# EasyEDA Pro project ProDoc_PCB7_2024-06-06.epro, board PCB7
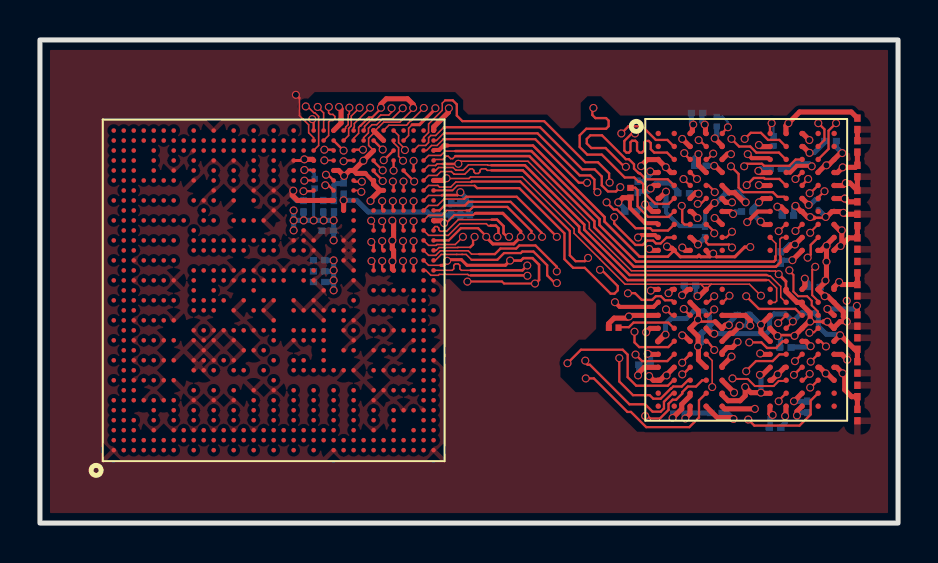
[diagram p0: board, top side]
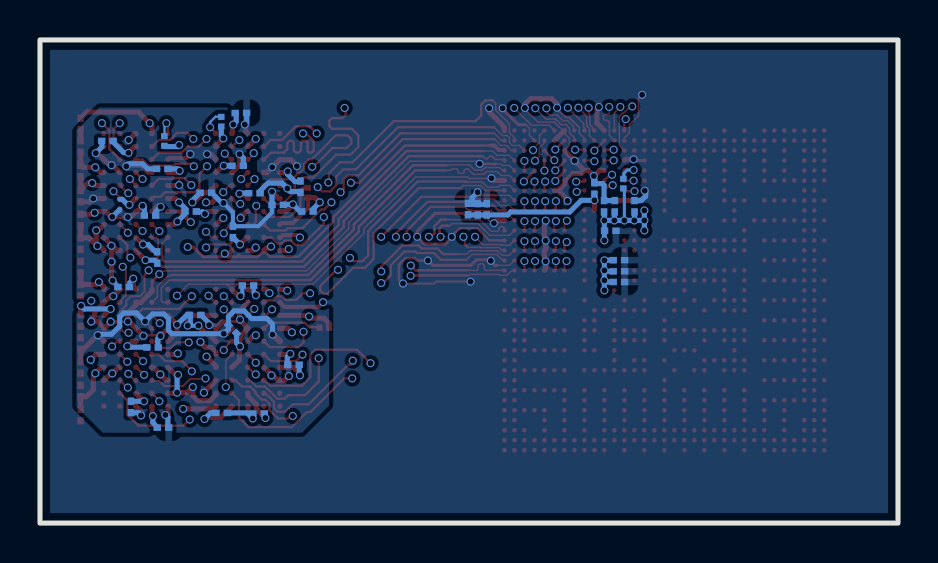
[diagram p1: board, bottom side, seen from below]

Outline 42.93 x 24.18 mm; copper layers: Top Layer, Inner1, Inner2, Inner3, Inner4, Inner5, Inner6, Bottom Layer. Coordinates in mm from the lower left corner of the outline.
Outline path: rectangle 0,24.18 42.93,0
Stack: Top Layer 0.035mm 外层铜厚1oz / Dielectric1 0.1164mm 2116 RC54% 4.9mil / Inner1 0.0152mm 内层铜厚 / Dielectric2 0.3mm 0.3mm H/HOZ 不含铜 / Inner2 0.0152mm 内层铜厚 / Dielectric3 0.0764mm 1080 RC67% 3.3mil / Inner3 0.0152mm 内层铜厚 / Dielectric4 0.0764mm 1080 RC67% 3.3mil / Inner4 0.0152mm 内层铜厚 / Dielectric5 0.3mm 0.3mm H/HOZ 不含铜 / Inner5 0.0152mm 内层铜厚 / Dielectric6 0.0764mm 1080 RC67% 3.3mil / Inner6 0.0152mm 内层铜厚 / Dielectric7 0.0764mm 1080 RC67% 3.3mil / Bottom Layer 0.035mm 外层铜厚1oz

## Design rules (mm)
net SDQM2: SDQ2
net SDQ22: SDQ2
net SDQ24: SDQ3
net SDQ21: SDQ2
net SDQ20: SDQ2
net SDQ31: SDQ3
net SDQ23: SDQ2
net SDQ19: SDQ2
net SDQ30: SDQ3
net SDQS2P: SDQ2
net SDQS2N: SDQ2
net SDQ26: SDQ3
net SDQ27: SDQ3
net SDQS3P: SDQ3
net SDQS3N: SDQ3
net SDQ17: SDQ2
net SDQM3: SDQ3
net SDQ18: SDQ2
net SDQ16: SDQ2
net SDQ28: SDQ3
net SDQ25: SDQ3
net SDQ29: SDQ3
net SAB2: SAA
net SAB3: SAA
net SAA5: SAA
net SAB0: SAA
net SCS0-B: SCK
net SCS1-B: SCK
net SCKE1-B: SCK
net SCKP-B: SCK
net SCKE0-B: SCK
net SAB1: SAA
net SAB5: SAA
net SCKN-B: SCK
net SAB4: SAA
net SCKE0-A: SCK
net SCS0-A: SCK
net SCKN-A: SCK
net SDQ14: SDQ1
net SAA4: SAA
net SDQ13: SDQ1
net SDQ12: SDQ1
net SDQ15: SDQ1
net SAA3: SAA
net SDQM1: SDQ1
net SDQS1P: SDQ1
net SDQS1N: SDQ1
net SDQ9: SDQ1
net SAA2: SAA
net SDQ10: SDQ1
net SDQ11: SDQ1
net SDQ8: SDQ1
net SCKP-A: SCK
net SCKE1-A: SCK
net SDQ1: SDQ0
net SDQ5: SDQ0
net SDQ7: SDQ0
net SDQ0: SDQ0
net SCS1-A: SCK
net SDQM0: SDQ0
net SDQS0P: SDQ0
net SDQS0N: SDQ0
net SDQ3: SDQ0
net SAA0: SAA
net SDQ4: SDQ0
net SDQ6: SDQ0
net SAA1: SAA
net SDQ2: SDQ0
template: 8L BGA
spacing safeClearance (default): track to track 0.076, other pairs 0.076 to 0.3
track width trackWidth (default): min 0.076, default 0.102, max 2.54
differential pair differentialPair (default): width min 0.102, default 0.254, max 2.54; gap min 0.102, default 0.102
via viaSize (default): diameter min 0.4, default 0.45, max 10; hole min 0.201, default 0.201, max 5.999
pour e746 uses DRAMCopper
pour e789 uses DRAMCopper
pour e875 uses DRAMCopper
pour e939 uses DRAMCopper
pour e1925 uses DRAMCopper

## Placement (name value [footprint] x y rotation side)
C1  2.2uF  [c0201 nsk]  33.83 5.51 180 bottom
C2  2.2uF  [c0201 nsk]  35.15 10.41 180 bottom
C3  100nF  [c0201 nsk]  36.78 4.78 0 bottom
C4  100nF  [c0201 nsk]  37.3 8.79 0 bottom
C5  100nF  [c0201 nsk]  39.55 19.13 180 bottom
C6  100nF  [c0201 nsk]  13.97 12.07 0 bottom
C7  100nF  [c0201 nsk]  13.97 12.6 0 bottom
C8  100nF  [c0201 nsk]  13.97 13.16 0 bottom
C9  100nF  [c0201 nsk]  14.71 15.85 270 bottom
C10  100nF  [c0201 nsk]  13.18 15.85 270 bottom
C11  100nF  [c0201 nsk]  14.17 15.85 270 bottom
C12  100nF  [c0201 nsk]  37.06 13.28 270 bottom
C13  100nF  [c0201 nsk]  36.8 17.73 180 bottom
C14  100nF  [c0201 nsk]  31.98 5.48 180 bottom
C15  100nF  [c0201 nsk]  32.51 11.89 180 bottom
C16  100nF  [c0201 nsk]  38.73 11.81 180 bottom
C17  2.2uF  [c0201 nsk]  15.19 16.75 90 bottom
C18  100nF  [c0201 nsk]  20.57 15.7 270 bottom
C19  2.2uF  [c0201 nsk]  40.89 8.99 90 top
C20  100nF  [c0201 nsk]  40.89 7.8 90 top
C21  100nF  [c0201 nsk]  37.41 15.39 180 bottom
C22  100nF  [c0201 nsk]  33.3 9.7 45 bottom
C23  100nF  [c0201 nsk]  31.04 15.93 0 bottom
C24  100nF  [c0201 nsk]  40.89 16.36 270 top
C25  100nF  [c0201 nsk]  33.27 14.58 90 bottom
C26  100nF  [c0201 nsk]  34.62 16.54 180 bottom
C27  2.2uF  [c0201 nsk]  30.25 7.92 0 bottom
C28  2.2uF  [c0201 nsk]  40.89 10.13 270 top
C29  100nF  [c0201 nsk]  35.39 15.6 0 bottom
C30  100nF  [c0201 nsk]  40.89 19.99 90 top
C31  100nF  [c0201 nsk]  40.89 18.85 270 top
C32  2.2uF  [c0201 nsk]  32.87 20.52 180 bottom
C33  100nF  [c0201 nsk]  40.89 17.63 90 top
C34  100nF  [c0201 nsk]  40.89 14 90 top
C35  100nF  [c0201 nsk]  40.89 11.66 90 top
C36  100nF  [c0201 nsk]  40.89 15.16 270 top
C37  100nF  [c0201 nsk]  40.89 12.8 270 top
C38  100nF  [c0201 nsk]  40.89 5.41 90 top
C39  100nF  [c0201 nsk]  40.89 6.6 270 top
C40  100nF  [c0201 nsk]  14.4 14.63 0 bottom
C41  100nF  [c0201 nsk]  33.05 17.88 0 bottom
C42  100nF  [c0201 nsk]  38.38 5.82 90 bottom
C43  100nF  [c0201 nsk]  32.21 16.51 0 bottom
C44  100nF  [c0201 nsk]  29.9 16.84 90 bottom
C45  100nF  [c0201 nsk]  29.54 15.6 180 bottom
C46  2.2uF  [c0201 nsk]  21.51 15.72 90 bottom
C47  100nF  [c0201 nsk]  21.03 15.7 270 bottom
R1  0  [r0201 nsk]  29.54 16.54 270 top
R2  0  [r0201 nsk]  28.7 9.78 180 top
R3  120  [r0201 nsk]  13.74 16.99 270 bottom
R4  240  [r0201 nsk]  33.86 20.09 270 bottom
R5  240  [r0201 nsk]  36.7 19.13 270 bottom
U1  T527  [T527-BGA664]  11.69 11.65 90 top
UD1  LPDDR4_FBGA200  [BGA200P65_80B1000_1500H90]  35.33 12.67 0 top

## Footprints (pads in the part's own frame, mm; a bottom-side part is the same pattern mirrored in y, then rotated)
BGA200P65_80B1000_1500H90
  round 0.27 smd: A1(-4.4,6.825) A2(-3.6,6.825) A3(-2.8,6.825) A4(-2,6.825) A5(-1.2,6.825) A8(1.2,6.825) A9(2,6.825) A10(2.8,6.825) A11(3.6,6.825) A12(4.4,6.825) AA1(-4.4,-6.175) AA2(-3.6,-6.175) AA3(-2.8,-6.175) AA4(-2,-6.175) AA5(-1.2,-6.175) AA8(1.2,-6.175) AA9(2,-6.175) AA10(2.8,-6.175) AA11(3.6,-6.175) AA12(4.4,-6.175) AB1(-4.4,-6.825) AB2(-3.6,-6.825) AB3(-2.8,-6.825) AB4(-2,-6.825) AB5(-1.2,-6.825) AB8(1.2,-6.825) AB9(2,-6.825) AB10(2.8,-6.825) AB11(3.6,-6.825) AB12(4.4,-6.825) B1(-4.4,6.175) B2(-3.6,6.175) B3(-2.8,6.175) B4(-2,6.175) B5(-1.2,6.175) B8(1.2,6.175) B9(2,6.175) B10(2.8,6.175) B11(3.6,6.175) B12(4.4,6.175) C1(-4.4,5.525) C2(-3.6,5.525) C3(-2.8,5.525) C4(-2,5.525) C5(-1.2,5.525) C8(1.2,5.525) C9(2,5.525) C10(2.8,5.525) C11(3.6,5.525) C12(4.4,5.525) D1(-4.4,4.875) D2(-3.6,4.875) D3(-2.8,4.875) D4(-2,4.875) D5(-1.2,4.875) D8(1.2,4.875) D9(2,4.875) D10(2.8,4.875) D11(3.6,4.875) D12(4.4,4.875) E1(-4.4,4.225) E2(-3.6,4.225) E3(-2.8,4.225) E4(-2,4.225) E5(-1.2,4.225) E8(1.2,4.225) E9(2,4.225) E10(2.8,4.225) E11(3.6,4.225) E12(4.4,4.225) F1(-4.4,3.575) F2(-3.6,3.575) F3(-2.8,3.575) F4(-2,3.575) F5(-1.2,3.575) F8(1.2,3.575) F9(2,3.575) F10(2.8,3.575) F11(3.6,3.575) F12(4.4,3.575) G1(-4.4,2.925) G2(-3.6,2.925) G3(-2.8,2.925) G4(-2,2.925) G5(-1.2,2.925) G8(1.2,2.925) G9(2,2.925) G10(2.8,2.925) G11(3.6,2.925) G12(4.4,2.925) H1(-4.4,2.275) H2(-3.6,2.275) H3(-2.8,2.275) H4(-2,2.275) H5(-1.2,2.275) H8(1.2,2.275) H9(2,2.275) H10(2.8,2.275) H11(3.6,2.275) H12(4.4,2.275) J1(-4.4,1.625) J2(-3.6,1.625) J3(-2.8,1.625) J4(-2,1.625) J5(-1.2,1.625) J8(1.2,1.625) J9(2,1.625) J10(2.8,1.625) J11(3.6,1.625) J12(4.4,1.625) K1(-4.4,0.975) K2(-3.6,0.975) K3(-2.8,0.975) K4(-2,0.975) K5(-1.2,0.975) K8(1.2,0.975) K9(2,0.975) K10(2.8,0.975) K11(3.6,0.975) K12(4.4,0.975) N1(-4.4,-0.975) N2(-3.6,-0.975) N3(-2.8,-0.975) N4(-2,-0.975) N5(-1.2,-0.975) N8(1.2,-0.975) N9(2,-0.975) N10(2.8,-0.975) N11(3.6,-0.975) N12(4.4,-0.975) P1(-4.4,-1.625) P2(-3.6,-1.625) P3(-2.8,-1.625) P4(-2,-1.625) P5(-1.2,-1.625) P8(1.2,-1.625) P9(2,-1.625) P10(2.8,-1.625) P11(3.6,-1.625) P12(4.4,-1.625) R1(-4.4,-2.275) R2(-3.6,-2.275) R3(-2.8,-2.275) R4(-2,-2.275) R5(-1.2,-2.275) R8(1.2,-2.275) R9(2,-2.275) R10(2.8,-2.275) R11(3.6,-2.275) R12(4.4,-2.275) T1(-4.4,-2.925) T2(-3.6,-2.925) T3(-2.8,-2.925) T4(-2,-2.925) T5(-1.2,-2.925) T8(1.2,-2.925) T9(2,-2.925) T10(2.8,-2.925) T11(3.6,-2.925) T12(4.4,-2.925) U1(-4.4,-3.575) U2(-3.6,-3.575) U3(-2.8,-3.575) U4(-2,-3.575) U5(-1.2,-3.575) U8(1.2,-3.575) U9(2,-3.575) U10(2.8,-3.575) U11(3.6,-3.575) U12(4.4,-3.575) V1(-4.4,-4.225) V2(-3.6,-4.225) V3(-2.8,-4.225) V4(-2,-4.225) V5(-1.2,-4.225) V8(1.2,-4.225) V9(2,-4.225) V10(2.8,-4.225) V11(3.6,-4.225) V12(4.4,-4.225) W1(-4.4,-4.875) W2(-3.6,-4.875) W3(-2.8,-4.875) W4(-2,-4.875) W5(-1.2,-4.875) W8(1.2,-4.875) W9(2,-4.875) W10(2.8,-4.875) W11(3.6,-4.875) W12(4.4,-4.875) Y1(-4.4,-5.525) Y2(-3.6,-5.525) Y3(-2.8,-5.525) Y4(-2,-5.525) Y5(-1.2,-5.525) Y8(1.2,-5.525) Y9(2,-5.525) Y10(2.8,-5.525) Y11(3.6,-5.525) Y12(4.4,-5.525)
c0201 nsk
  rect 0.368x0.324 smd: 1(-0.292,0) 2(0.28,0)
r0201 nsk
  rect 0.303x0.324 smd: 1(-0.241,0) 2(0.241,0)
T527-BGA664
  round 0.229 smd: A1(-8,8) A2(-7.5,8) A3(-7,8) A4(-6.5,8) A5(-6,8) A6(-5.5,8) A8(-4.5,8) A10(-3.5,8) A12(-2.5,8) A14(-1.5,8) A16(-0.5,8) A18(0.5,8) A20(1.5,8) A22(2.5,8) A24(3.5,8) A26(4.5,8) A28(5.5,8) A29(6,8) A30(6.5,8) A31(7,8) A32(7.5,8) A33(8,8) AA1(-8,-2) AA2(-7.5,-2) AA3(-7,-2) AA4(-6.5,-2) AA5(-6,-2) AA6(-5.5,-2) AA7(-5,-2) AA9(-4,-2) AA12(-2.5,-2) AA13(-2,-2) AA15(-1,-2) AA16(-0.5,-2) AA18(0.5,-2) AA19(1,-2) AA21(2,-2) AA22(2.5,-2) AA24(3.5,-2) AA26(4.5,-2) AA27(5,-2) AA28(5.5,-2) AA29(6,-2) AA30(6.5,-2) AA31(7,-2) AA32(7.5,-2) AA33(8,-2) AB2(-7.5,-2.501) AB3(-7,-2.5) AB9(-4,-2.501) AB10(-3.5,-2.5) AB11(-3,-2.5) AB12(-2.5,-2.5) AB13(-2,-2.5) AB14(-1.5,-2.5) AB15(-1,-2.5) AB17(0,-2.5) AB24(3.5,-2.5) AB32(7.5,-2.501) AB33(8,-2.5) AC1(-8,-3) AC2(-7.5,-3) AC3(-7,-3) AC4(-6.5,-3) AC5(-6,-3) AC6(-5.5,-3) AC7(-5,-3) AC9(-4,-3) AC15(-1,-3) AC17(0,-3) AC18(0.5,-3) AC19(1,-3) AC20(1.5,-3) AC22(2.5,-3) AC24(3.5,-3) AC26(4.5,-3) AC27(5,-3) AC28(5.5,-3) AC29(6,-3) AC30(6.5,-3) AC31(7,-3) AC32(7.5,-3) AC33(8,-3) AD1(-8,-3.5) AD2(-7.5,-3.5) AD9(-4,-3.5) AD11(-3,-3.5) AD13(-2,-3.5) AD14(-1.5,-3.5) AD15(-1,-3.5) AD20(1.5,-3.5) AD21(2,-3.5) AD22(2.5,-3.5) AD25(4,-3.5) AD32(7.5,-3.5) AD33(8,-3.5) AE1(-8,-4) AE2(-7.5,-4) AE3(-7,-4) AE4(-6.5,-4) AE5(-6,-4) AE6(-5.5,-4) AE7(-5,-4) AE9(-4,-4) AE11(-3,-4) AE12(-2.501,-4) AE13(-2,-4) AE14(-1.5,-4) AE16(-0.5,-4) AE18(0.5,-4) AE19(1,-4) AE20(1.5,-4) AE21(2,-4) AE22(2.501,-4) AE23(3,-4) AE24(3.5,-4) AE25(4,-4) AE26(4.5,-4) AE27(5,-4) AE28(5.5,-4) AE29(6,-4) AE30(6.5,-4) AE31(7,-4) AE32(7.5,-4) AE33(8,-4) AF1(-8,-4.5) AF2(-7.5,-4.5) AF32(7.5,-4.5) AF33(8,-4.5) AG1(-8,-5) AG2(-7.5,-5) AG3(-7,-5) AG4(-6.5,-5) AG5(-6,-5) AG6(-5.5,-5) AG7(-5,-5) AG9(-4,-5) AG11(-3,-5) AG13(-2,-5) AG15(-1,-5) AG17(0,-5) AG19(1,-5) AG21(2,-5) AG23(3,-5) AG25(4,-5) AG28(5.5,-5) AG29(6,-5) AG30(6.5,-5) AG31(7,-5) AG32(7.5,-5) AG33(8,-5) AH1(-8,-5.5) AH2(-7.5,-5.5) AH7(-5,-5.5) AH9(-4,-5.5) AH11(-3,-5.5) AH13(-2,-5.5) AH15(-1,-5.5) AH17(0,-5.5) AH19(1,-5.5) AH21(2,-5.5) AH23(3,-5.5) AH25(4,-5.5) AH27(5,-5.5) AH32(7.5,-5.5) AH33(8,-5.5) AJ1(-8,-6) AJ2(-7.5,-6) AJ3(-7,-6) AJ4(-6.5,-6) AJ5(-6,-6) AJ7(-5,-6) AJ9(-4,-6) AJ11(-3,-6) AJ13(-2,-6) AJ15(-1,-6) AJ17(0,-6) AJ19(1,-6) AJ21(2,-6) AJ23(3,-6) AJ25(4,-6) AJ27(5,-6) AJ30(6.5,-6) AJ31(7,-6) AJ32(7.5,-6) AJ33(8,-6) AK1(-8,-6.5) AK2(-7.5,-6.5) AK5(-6,-6.5) AK7(-5,-6.5) AK9(-4,-6.5) AK11(-3,-6.5) AK13(-2,-6.5) AK15(-1,-6.5) AK17(0,-6.5) AK19(1,-6.5) AK21(2,-6.5) AK23(3,-6.5) AK25(4,-6.5) AK27(5,-6.5) AK29(6,-6.5) AK32(7.5,-6.5) AK33(8,-6.5) AL1(-8,-7) AL2(-7.5,-7) AL3(-7,-7) AL5(-6,-7) AL7(-5,-7) AL9(-4,-7) AL11(-3,-7) AL12(-2.5,-7) AL13(-2,-7) AL14(-1.5,-7) AL15(-1,-7) AL16(-0.5,-7) AL17(0,-7) AL19(1,-7) AL21(2,-7) AL23(3,-7) AL25(4,-7) AL27(5,-7) AL29(6,-7) AL31(7,-7) AL32(7.5,-7) AL33(8,-7) AM1(-8,-7.5) AM2(-7.5,-7.5) AM3(-7,-7.5) AM4(-6.5,-7.5) AM5(-6,-7.5) AM6(-5.5,-7.5) AM7(-5,-7.5) AM8(-4.5,-7.5) AM9(-4,-7.5) AM10(-3.5,-7.5) AM11(-3,-7.5) AM12(-2.501,-7.5) AM13(-2,-7.5) AM14(-1.5,-7.5) AM15(-1,-7.5) AM16(-0.5,-7.5) AM17(0,-7.5) AM18(0.5,-7.5) AM19(1,-7.5) AM20(1.5,-7.5) AM21(2,-7.5) AM22(2.501,-7.5) AM23(3,-7.5) AM24(3.5,-7.5) AM25(4,-7.5) AM26(4.5,-7.5) AM27(5,-7.5) AM28(5.5,-7.5) AM29(6,-7.5) AM30(6.5,-7.5) AM31(7,-7.5) AM32(7.5,-7.5) AM33(8,-7.5) AN1(-8,-8) AN2(-7.5,-8) AN3(-7,-8) AN4(-6.5,-8) AN5(-6,-8) AN6(-5.5,-8) AN7(-5,-8) AN8(-4.5,-8) AN9(-4,-8) AN10(-3.5,-8) AN11(-3,-8) AN13(-2,-8) AN15(-1,-8) AN17(0,-8) AN18(0.5,-8) AN19(1,-8) AN20(1.5,-8) AN21(2,-8) AN22(2.5,-8) AN23(3,-8) AN24(3.5,-8) AN25(4,-8) AN26(4.5,-8) AN27(5,-8) AN28(5.5,-8) AN29(6,-8) AN30(6.5,-8) AN31(7,-8) AN32(7.5,-8) AN33(8,-8) B1(-8,7.5) B2(-7.5,7.5) B3(-7,7.5) B4(-6.5,7.5) B5(-6,7.5) B6(-5.5,7.5) B7(-5,7.5) B8(-4.5,7.5) B9(-4,7.5) B10(-3.5,7.5) B11(-3,7.5) B12(-2.501,7.5) B13(-2,7.5) B14(-1.5,7.5) B15(-1,7.5) B16(-0.5,7.5) B17(0,7.5) B18(0.5,7.5) B19(1,7.5) B20(1.5,7.5) B21(2,7.5) B22(2.501,7.5) B23(3,7.5) B24(3.5,7.5) B25(4,7.5) B26(4.5,7.5) B27(5,7.5) B28(5.5,7.5) B29(6,7.5) B30(6.5,7.5) B31(7,7.5) B32(7.5,7.5) B33(8,7.5) C1(-8,7) C2(-7.5,7) C3(-7,7) C4(-6.5,7) C6(-5.5,7) C7(-5,7) C8(-4.5,7) C9(-4,7) C10(-3.5,7) C11(-3,7) C12(-2.5,7) C13(-2,7) C14(-1.5,7) C15(-1,7) C16(-0.5,7) C17(0,7) C18(0.5,7) C19(1,7) C20(1.5,7) C21(2,7) C22(2.5,7) C23(3,7) C24(3.5,7) C25(4,7) C26(4.5,7) C27(5,7) C28(5.5,7) C29(6,7) C30(6.5,7) C31(7,7) C32(7.5,7) C33(8,7) D1(-8,6.5) D2(-7.5,6.5) D6(-5.5,6.5) D8(-4.5,6.5) D10(-3.5,6.5) D12(-2.5,6.5) D14(-1.5,6.5) D16(-0.5,6.5) D18(0.5,6.5) D20(1.5,6.5) D22(2.5,6.5) D24(3.5,6.5) D26(4.5,6.5) D28(5.5,6.5) D32(7.5,6.5) D33(8,6.5) E1(-8,6) E2(-7.5,6) E3(-7,6) E4(-6.5,6) E5(-6,6) E6(-5.5,6) E8(-4.5,6) E10(-3.5,6) E12(-2.5,6) E14(-1.5,6) E16(-0.5,6) E18(0.5,6) E20(1.5,6) E22(2.5,6) E24(3.5,6) E26(4.5,6) E28(5.5,6) E29(6,6) E30(6.5,6) E31(7,6) E32(7.5,6) E33(8,6) F1(-8,5.5) F2(-7.5,5.5) F6(-5.5,5.5) F8(-4.5,5.5) F10(-3.5,5.5) F12(-2.5,5.5) F14(-1.5,5.5) F16(-0.5,5.5) F18(0.5,5.5) F20(1.5,5.5) F22(2.5,5.5) F24(3.5,5.5) F26(4.5,5.5) F28(5.5,5.5) F32(7.5,5.5) F33(8,5.5) G1(-8,5) G2(-7.5,5) G3(-7,5) G4(-6.5,5) G5(-6,5) G6(-5.5,5) G8(-4.5,5) G10(-3.5,5) G12(-2.5,5) G14(-1.5,5) G16(-0.5,5) G18(0.5,5) G20(1.5,5) G22(2.5,5) G24(3.5,5) G26(4.5,5) G28(5.5,5) G29(6,5) G30(6.5,5) G31(7,5) G32(7.5,5) G33(8,5) H2(-7.5,4.5) H3(-7,4.5) H24(3.5,4.5) H31(7,4.5) H32(7.5,4.5) J1(-8,4) J2(-7.5,4) J3(-7,4) J4(-6.5,4) J5(-6,4) J6(-5.5,4) J7(-5,4) J9(-4,4) J10(-3.5,4) J12(-2.501,4) J13(-2,4) J15(-1,4) J16(-0.5,4) J17(0,4) J18(0.5,4) J19(1,4) J21(2,4) J22(2.501,4) J23(3,4) J26(4.5,4) J28(5.5,4) J29(6,4) J30(6.5,4) J31(7,4) J32(7.5,4) J33(8,4) K2(-7.5,3.5) K3(-7,3.5) K9(-4,3.5) K10(-3.5,3.5) K11(-3,3.5) K12(-2.5,3.5) K13(-2,3.5) K15(-1,3.5) K16(-0.5,3.5) K19(1,3.5) K21(2,3.5) K22(2.5,3.5) K24(3.5,3.5) K25(4,3.5) K26(4.5,3.5) K31(7,3.5) K32(7.5,3.5) L1(-8,3) L2(-7.5,3) L3(-7,3) L4(-6.5,3) L5(-6,3) L6(-5.5,3) L7(-5,3) L9(-4,3) L10(-3.5,3) L12(-2.5,3) L13(-2,3) L15(-1,3) L16(-0.5,3) L17(0,3) L18(0.5,3) L19(1,3) L21(2,3) L22(2.5,3) L24(3.5,3) L26(4.5,3) L27(5,3) L28(5.5,3) L29(6,3) L30(6.5,3) L31(7,3) L32(7.5,3) L33(8,3) M2(-7.5,2.501) M3(-7,2.5) M10(-3.5,2.5) M13(-2,2.5) M16(-0.5,2.5) M18(0.5,2.5) M19(1,2.5) M21(2,2.5) M22(2.5,2.5) M31(7,2.5) M32(7.5,2.501) N1(-8,2) N2(-7.5,2) N3(-7,2) N4(-6.5,2) N5(-6,2) N6(-5.5,2) N7(-5,2) N9(-4,2) N10(-3.5,2) N12(-2.5,2) N13(-2,2) N15(-1,2) N18(0.5,2) N19(1,2) N21(2,2) N22(2.5,2) N24(3.5,2) N26(4.5,2) N27(5,2) N28(5.5,2) N29(6,2) N30(6.5,2) N31(7,2) N32(7.5,2) N33(8,2) P2(-7.5,1.5) P3(-7,1.5) P9(-4,1.5) P11(-3,1.5) P13(-2,1.5) P16(-0.5,1.5) P18(0.5,1.5) P19(1,1.5) P21(2,1.5) P22(2.5,1.5) P24(3.5,1.5) P31(7,1.5) P32(7.5,1.5) R1(-8,1) R2(-7.5,1) R3(-7,1) R4(-6.5,1) R5(-6,1) R6(-5.5,1) R7(-5,1) R11(-3,1) R13(-2,1) R15(-1,1) R17(0,1) R18(0.5,1) R19(1,1) R22(2.5,1) R24(3.5,1) R26(4.5,1) R27(5,1) R28(5.5,1) R29(6,1) R30(6.5,1) R31(7,1) R32(7.5,1) R33(8,1) T2(-7.5,0.5) T3(-7,0.5) T9(-4,0.5) T11(-3,0.5) T13(-2,0.5) T15(-1,0.5) T16(-0.5,0.5) T18(0.5,0.5) T19(1,0.5) T21(2,0.5) T22(2.5,0.5) T24(3.5,0.5) T31(7,0.5) T32(7.5,0.5) U1(-8,0) U2(-7.5,0) U3(-7,0) U4(-6.5,0) U5(-6,0) U6(-5.5,0) U7(-5,0) U8(-4.5,0) U10(-3.5,0) U12(-2.5,0) U13(-2,0) U14(-1.5,0) U16(-0.5,0) U18(0.5,0) U19(1,0) U21(2,0) U22(2.5,0) U25(4,0) U26(4.5,0) U27(5,0) U28(5.5,0) U29(6,0) U30(6.5,0) U31(7,0) U32(7.5,0) U33(8,0) V2(-7.5,-0.5) V3(-7,-0.5) V18(0.5,-0.5) V19(1,-0.5) V31(7,-0.5) V32(7.5,-0.5) W1(-8,-1) W2(-7.5,-1) W3(-7,-1) W4(-6.5,-1) W5(-6,-1) W6(-5.5,-1) W7(-5,-1) W9(-4,-1) W10(-3.5,-1) W12(-2.5,-1) W13(-2,-1) W15(-1,-1) W16(-0.5,-1) W19(1,-1) W21(2,-1) W22(2.5,-1) W23(3,-1) W24(3.5,-1) W25(4,-1) W27(5,-1) W28(5.5,-1) W29(6,-1) W30(6.5,-1) W31(7,-1) W32(7.5,-1) W33(8,-1) Y2(-7.5,-1.5) Y3(-7,-1.5) Y9(-4,-1.5) Y10(-3.5,-1.5) Y12(-2.5,-1.5) Y13(-2,-1.5) Y15(-1,-1.5) Y18(0.5,-1.5) Y19(1,-1.5) Y21(2,-1.5) Y22(2.5,-1.5) Y23(3,-1.5) Y24(3.5,-1.5) Y26(4.5,-1.5) Y31(7,-1.5) Y32(7.5,-1.5)

## Nets
GND: C1.2 C2.2 C3.1 C4.1 C5.1 C6.1 C7.1 C8.1 C9.1 C10.1 C11.1 C12.1 C13.1 C14.1 C15.1 C16.1 C17.2 C18.1 C19.2 C20.1 C21.1 C22.1 C23.1 C24.1 C25.1 C26.1 C27.2 C28.2 C29.1 C30.1 C31.1 C32.2 C33.1 C34.1 C35.1 C36.1 C37.1 C38.1 C39.1 C40.1 C41.1 C42.1 C43.1 C44.1 C45.1 C46.2 C47.1 U1.A1 U1.AA15 U1.AA16 U1.AA18 U1.AA21 U1.AA22 U1.AA26 U1.AA30 U1.AA32 U1.AB10 U1.AB11 U1.AB12 U1.AB14 U1.AB15 U1.AB17 U1.AC1 U1.AC26 U1.AC29 U1.AC33 U1.AD9 U1.AD11 U1.AD13 U1.AD14 U1.AD20 U1.AD21 U1.AD22 U1.AE9 U1.AE12 U1.AE14 U1.AE18 U1.AE19 U1.AE20 U1.AE21 U1.AE22 U1.AE23 U1.AE24 U1.AE25 U1.AE26 U1.AE29 U1.AE32 U1.AG3 U1.AG6 U1.AG7 U1.AG11 U1.AG25 U1.AG28 U1.AG31 U1.AG33 U1.AH7 U1.AH9 U1.AH27 U1.AH32 U1.AJ13 U1.AJ19 U1.AJ21 U1.AJ23 U1.AK5 U1.AK11 U1.AK32 U1.AL3 U1.AL9 U1.AL12 U1.AL13 U1.AL14 U1.AM5 U1.AM20 U1.AM26 U1.AM29 U1.AN1 U1.AN10 U1.AN11 U1.AN18 U1.AN22 U1.AN24 U1.AN28 U1.AN31 U1.AN33 U1.C6 U1.C8 U1.C10 U1.C12 U1.C14 U1.C18 U1.C20 U1.D6 U1.E3 U1.F6 U1.F8 U1.F10 U1.F12 U1.G3 U1.G8 U1.G10 U1.G14 U1.G18 U1.G29 U1.J3 U1.J6 U1.J9 U1.J10 U1.J12 U1.J13 U1.J28 U1.J31 U1.K9 U1.K10 U1.K11 U1.K12 U1.K26 U1.L3 U1.L6 U1.L10 U1.L12 U1.L13 U1.L27 U1.L30 U1.L33 U1.M13 U1.N3 U1.N6 U1.N10 U1.N12 U1.N15 U1.N18 U1.N19 U1.N22 U1.N26 U1.N27 U1.N30 U1.P11 U1.P16 U1.P19 U1.P24 U1.R3 U1.R7 U1.R11 U1.R13 U1.R19 U1.R24 U1.R27 U1.T15 U1.T16 U1.T18 U1.T24 U1.U7 U1.U14 U1.U16 U1.U25 U1.U27 U1.V18 U1.V19 U1.W12 U1.W13 U1.W15 U1.W16 U1.W22 U1.W27 U1.W30 U1.Y15 U1.Y18 U1.Y22 U1.Y23 U1.Y26 UD1.A3 UD1.A10 UD1.AB3 UD1.AB5 UD1.AB8 UD1.AB10 UD1.C1 UD1.C5 UD1.C8 UD1.C12 UD1.D2 UD1.D4 UD1.D9 UD1.D11 UD1.E1 UD1.E5 UD1.E8 UD1.E12 UD1.G1 UD1.G3 UD1.G5 UD1.G8 UD1.G10 UD1.G12 UD1.J1 UD1.J3 UD1.J10 UD1.J12 UD1.K2 UD1.K4 UD1.K9 UD1.K11 UD1.N2 UD1.N4 UD1.N9 UD1.N11 UD1.P1 UD1.P3 UD1.P10 UD1.P12 UD1.T1 UD1.T3 UD1.T5 UD1.T8 UD1.T10 UD1.T12 UD1.V1 UD1.V5 UD1.V8 UD1.V12 UD1.W2 UD1.W4 UD1.W9 UD1.W11 UD1.Y1 UD1.Y5 UD1.Y8 UD1.Y12
VCC-DRAM: C1.1 C2.1 C3.2 C4.2 C5.2 C6.2 C7.2 C8.2 C9.2 C10.2 C11.2 C12.2 C13.2 C14.2 C15.2 C16.2 C27.1 C28.1 C29.2 C30.2 C31.2 C32.1 C33.2 C34.2 C35.2 C36.2 C37.2 C38.2 C39.2 C40.2 C41.2 C42.2 C43.2 C44.2 C45.2 R1.2 R2.2 R3.2 R4.2 R5.2 U1.AA24 U1.AB24 U1.AC17 U1.AC18 U1.AC19 U1.AC20 U1.AC22 U1.AC24 U1.W23 U1.W24 U1.W25 U1.Y24 UD1.A4 UD1.A9 UD1.AA3 UD1.AA5 UD1.AA8 UD1.AA10 UD1.AB4 UD1.AB9 UD1.B3 UD1.B5 UD1.B8 UD1.B10 UD1.D1 UD1.D5 UD1.D8 UD1.D12 UD1.F3 UD1.F5 UD1.F8 UD1.F10 UD1.H1 UD1.H5 UD1.H8 UD1.H12 UD1.K1 UD1.K3 UD1.K10 UD1.K12 UD1.N1 UD1.N3 UD1.N10 UD1.N12 UD1.R1 UD1.R5 UD1.R8 UD1.R12 UD1.U3 UD1.U5 UD1.U8 UD1.U10 UD1.W1 UD1.W5 UD1.W8 UD1.W12
VDD18-DRAM: C17.1 C18.2 C46.1 C47.2 U1.AD25
VDD18-LPDDR: C19.1 C20.2 C21.2 C22.2 C23.2 C24.2 C25.2 C26.2 UD1.F1 UD1.F12 UD1.G4 UD1.G9 UD1.T4 UD1.T9 UD1.U1 UD1.U12
SAA0: U1.AJ33 UD1.H2
SAA1: U1.AJ32 UD1.J2
SAA2: U1.AG30 UD1.H9
SAA3: U1.AG29 UD1.H10
SAA4: U1.AJ30 UD1.H11
SAA5: U1.AJ31 UD1.J11
SAB0: U1.AJ25 UD1.R2
SAB1: U1.AH25 UD1.P2
SAB2: U1.AL25 UD1.R9
SAB3: U1.AK25 UD1.R10
SAB4: U1.AJ27 UD1.R11
SAB5: U1.AL29 UD1.P11
SCKE0-A: U1.AM31 UD1.J4
SCKE0-B: U1.AN27 UD1.P4
SCKE1-A: U1.AL31 UD1.J5
SCKE1-B: U1.AM27 UD1.P5
SCKN-A: U1.AN30 UD1.J9
SCKN-B: U1.AN29 UD1.P9
SCKP-A: U1.AM30 UD1.J8
SCKP-B: U1.AM28 UD1.P8
SCS0-A: U1.AN32 UD1.H4
SCS0-B: U1.AK29 UD1.R4
SCS1-A: U1.AM32 UD1.H3
SCS1-B: U1.AK27 UD1.R3
SDQ0: U1.AE28 UD1.E4
SDQ1: U1.AE27 UD1.F4
SDQ2: U1.AG32 UD1.E2
SDQ3: U1.AH33 UD1.F2
SDQ4: U1.AE30 UD1.B2
SDQ5: U1.AD32 UD1.B4
SDQ6: U1.AE31 UD1.C2
SDQ7: U1.AD33 UD1.C4
SDQ8: U1.AC27 UD1.E9
SDQ9: U1.AC28 UD1.F9
SDQ10: U1.AC30 UD1.B9
SDQ11: U1.AC31 UD1.C9
SDQ12: U1.AA33 UD1.C11
SDQ13: U1.AA31 UD1.B11
SDQ14: U1.AA28 UD1.F11
SDQ15: U1.AA27 UD1.E11
SDQ16: U1.AM25 UD1.U2
SDQ17: U1.AN25 UD1.V2
SDQ18: U1.AH23 UD1.U4
SDQ19: U1.AK23 UD1.Y2
SDQ20: U1.AL23 UD1.V4
SDQ21: U1.AM22 UD1.AA2
SDQ22: U1.AN21 UD1.AA4
SDQ23: U1.AG21 UD1.Y4
SDQ24: U1.AG19 UD1.AA9
SDQ25: U1.AH19 UD1.AA11
SDQ26: U1.AK19 UD1.V11
SDQ27: U1.AL19 UD1.Y11
SDQ28: U1.AM21 UD1.U9
SDQ29: U1.AL21 UD1.U11
SDQ30: U1.AK21 UD1.Y9
SDQ31: U1.AH21 UD1.V9
SDQM0: U1.AE33 UD1.C3
SDQM1: U1.AC32 UD1.C10
SDQM2: U1.AM24 UD1.Y3
SDQM3: U1.AN20 UD1.Y10
SDQS0N: U1.AF33 UD1.E3
SDQS0P: U1.AF32 UD1.D3
SDQS1N: U1.AB33 UD1.E10
SDQS1P: U1.AB32 UD1.D10
SDQS2N: U1.AN23 UD1.V3
SDQS2P: U1.AM23 UD1.W3
SDQS3N: U1.AN19 UD1.V10
SDQS3P: U1.AM19 UD1.W10
SRST: U1.AG23 UD1.T11
$1N11425: R3.1 U1.AA29
$1N11433: R4.1 UD1.A5
$1N11434: R5.1 UD1.A8
$1N11438: R1.1 UD1.G2
$1N11439: R2.1 UD1.T2

Pads without a net: U1 A2 A3 A4 A5 A6 A8 A10 A12 A14 A16 A18 A20 A22 A24 A26 A28 A29 A30 A31 A32 A33 AA1 AA2 AA3 AA4 AA5 AA6 AA7 AA9 AA12 AA13 AA19 AB2 AB3 AB9 AB13 AC2 AC3 AC4 AC5 AC6 AC7 AC9 AC15 AD1 AD2 AD15 AE1 AE2 AE3 AE4 AE5 AE6 AE7 AE11 AE13 AE16 AF1 AF2 AG1 AG2 AG4 AG5 AG9 AG13 AG15 AG17 AH1 AH2 AH11 AH13 AH15 AH17 AJ1 AJ2 AJ3 AJ4 AJ5 AJ7 AJ9 AJ11 AJ15 AJ17 AK1 AK2 AK7 AK9 AK13 AK15 AK17 AK33 AL1 AL2 AL5 AL7 AL11 AL15 AL16 AL17 AL27 AL32 AL33 AM1 AM2 AM3 AM4 AM6 AM7 AM8 AM9 AM10 AM11 AM12 AM13 AM14 AM15 AM16 AM17 AM18 AM33 AN2 AN3 AN4 AN5 AN6 AN7 AN8 AN9 AN13 AN15 AN17 AN26 B1 B2 B3 B4 B5 B6 B7 B8 B9 B10 B11 B12 B13 B14 B15 B16 B17 B18 B19 B20 B21 B22 B23 B24 B25 B26 B27 B28 B29 B30 B31 B32 B33 C1 C2 C3 C4 C7 C9 C11 C13 C15 C16 C17 C19 C21 C22 C23 C24 C25 C26 C27 C28 C29 C30 C31 C32 C33 D1 D2 D8 D10 D12 D14 D16 D18 D20 D22 D24 D26 D28 D32 D33 E1 E2 E4 E5 E6 E8 E10 E12 E14 E16 E18 E20 E22 E24 E26 E28 E29 E30 E31 E32 E33 F1 F2 F14 F16 F18 F20 F22 F24 F26 F28 F32 F33 G1 G2 G4 G5 G6 G12 G16 G20 G22 G24 G26 G28 G30 G31 G32 G33 H2 H3 H24 H31 H32 J1 J2 J4 J5 J7 J15 J16 J17 J18 J19 J21 J22 J23 J26 J29 J30 J32 J33 K2 K3 K13 K15 K16 K19 K21 K22 K24 K25 K31 K32 L1 L2 L4 L5 L7 L9 L15 L16 L17 L18 L19 L21 L22 L24 L26 L28 L29 L31 L32 M2 M3 M10 M16 M18 M19 M21 M22 M31 M32 N1 N2 N4 N5 N7 N9 N13 N21 N24 N28 N29 N31 N32 N33 P2 P3 P9 P13 P18 P21 P22 P31 P32 R1 R2 R4 R5 R6 R15 R17 R18 R22 R26 R28 R29 R30 R31 R32 R33 T2 T3 T9 T11 T13 T19 T21 T22 T31 T32 U1 U2 U3 U4 U5 U6 U8 U10 U12 U13 U18 U19 U21 U22 U26 U28 U29 U30 U31 U32 U33 V2 V3 V31 V32 W1 W2 W3 W4 W5 W6 W7 W9 W10 W19 W21 W28 W29 W31 W32 W33 Y2 Y3 Y9 Y10 Y12 Y13 Y19 Y21 Y31 Y32; UD1 A1 A2 A11 A12 AA1 AA12 AB1 AB2 AB11 AB12 B1 B12 G11 K5 K8 N5 N8

## Via types
v1: diameter 0.4, hole 0.3, Top Layer to Bottom Layer, 282 vias

## Routing (per net, layer and track width the routed paths; a pad name or vN(x,y) marks a point on that pad's centre or on a via; arc(x,y) is an arc through that point)
GND: length 193.2
  Top Layer w0.076: v1(36.07,11.38) 35.49,11.96 33.58,11.96 ; U1.AM26 19.44,16.4 20.11,16.4 ; U1.AM29 19.44,17.9 19.79,17.9 19.79,17.9 19.87,17.98 20.15,17.98 ; v1(20.93,17.98) 21.06,18.11 24.41,18.11 27.48,15.04 27.48,14.73 29.59,12.63 36.48,12.63 36.49,12.62 36.8,12.62 v1(36.96,12.46) ; 16.69,19.51 16.44,19.26 16.44,18.9 U1.AG31 ; U1.AG33 16.77,19.65 16.94,19.81 16.94,19.81 17.2,20.07 18.01,20.07 18.67,20.73 v1(18.67,20.78) ; 12.88,21.32 12.78,21.42 12.79,21.43 v1(12.8,21.43) ; 33.58,11.96 33.32,11.69 33.06,11.96 ; 33.58,11.96 33.06,11.96 ; 33.06,11.96 29.27,11.96 28,13.22 28,13.22 26.72,14.5 26.72,14.73 24.13,17.32 21.54,17.32 21.46,17.25 20.4,17.25 20.38,17.26 v1(20.34,17.26) ; 16.03,19.89 15.94,19.8 15.94,19.51 15.69,19.26 U1.AE32 ; 12.98,21.27 12.98,20.4 13.44,19.93 13.44,19.54 13.69,19.29 U1.AA32 ; U1.AK32 18.44,19.4 18.44,19.76 18.62,19.94 ; 20.05,12.9 19.44,12.9 U1.AM20
  Top Layer w0.102: v1(21.39,12.08) 21.39,12.09 23.11,12.09 23.22,11.99 v1(24.77,11.99) ; v1(20.22,15.01) 20.32,15.01 20.72,15.42 21.67,15.42 21.76,15.5 21.8,15.5 ; 16.69,19.51 U1.AG33 ; 16.03,19.89 16.04,19.89 16.46,20.31 16.62,20.31 17.06,20.74 v1(17.06,20.79)
  Top Layer w0.115: U1.AN22 20.45,14.15 21.06,14.76 21.92,14.76 22.33,14.35 v1(22.33,14.33)
  Top Layer w0.127: v1(20.93,17.98) 20.86,17.98 20.86,17.98 20.15,17.98 ; v1(37.75,9.37) 37.71,9.41 36.94,9.41 v1(36.9,9.36) ; 33.78,10.08 33.02,10.08 v1(32.92,10.18) ; v1(24.77,11.99) 24.79,11.99 24.97,12.17 24.97,12.93 24.64,13.26 24.18,13.26 24.06,13.14 v1(23.52,13.14) ; 20.11,16.4 20.13,16.42 20.89,16.42 v1(21.03,16.56) ; 31.72,13.64 31.41,13.34 30,13.34 28.24,15.09 28.24,15.32 24.66,18.9 20.39,18.9 ; v1(38.53,10.08) 38.54,10.08 39.2,10.08 ; v1(12.8,21.43) 12.8,21.38 12.87,21.38 12.98,21.27 ; 38.71,15.28 39.31,15.28 ; 37.32,11.69 37.32,12.09
  Top Layer w0.152: 20.05,12.9 20.17,12.9 20.37,13.1 v1(20.37,13.13) 20.43,13.18 21.08,13.18 21.36,12.9 23.29,12.9 v1(23.52,13.14) ; 18.62,19.94 18.99,19.94 19.77,20.73 19.77,20.76 v1(19.78,20.76) ; 31.72,13.64 32.04,13.33 32.88,13.33 32.97,13.41 33.05,13.33 33.52,13.33 v1(33.68,13.49) 33.84,13.33 34.76,13.33 35.26,13.82 v1(35.53,13.82) ; v1(36.96,12.46) 37.32,12.09 ; 21.8,15.5 23.15,15.5 24.05,14.61 v1(24.05,14.33) 23.7,13.97 22.66,13.97 22.33,14.3 v1(22.33,14.33) ; v1(13.23,18.2) 13.17,18.15 U1.W30
  Top Layer w0.203: 20.39,18.9 20.19,18.9 19.97,18.67 19.72,18.67 U1.AN31 ; 36.52,18.19 36.45,18.26 35.61,18.26 v1(35.41,18.47) ; v1(29.92,14.29) 29.93,14.3 29.97,14.3 30.09,14.41 30.77,14.41 30.89,14.29 30.92,14.29 ; v1(35.38,15.06) 35.91,15.59 36.52,15.59 ; U1.AG28 16.63,17.15 16.28,17.5 ; 30.92,11.04 30.7,10.82 29,10.82 v1(28.76,11.06) ; 37.32,17.54 37.53,17.54 37.87,17.88 38.58,17.88 v1(38.61,17.86)
  Top Layer w0.254: 31.72,13.64 31.6,13.76 31.45,13.76 v1(31.37,13.84) ; v1(34.57,18.47) 34.39,18.47 34.12,18.19 ; 32.52,5.84 32.52,5.47 v1(32.28,5.23) ; 34.12,16.89 34.48,16.54 34.75,16.54 35.23,16.05 v1(35.31,16.05) ; 39.72,14.29 39.35,13.92 v1(39.35,13.88) ; C33.1 C24.1 40.53,17.02 v1(40.31,17.02) 40.19,16.89 39.72,16.89 ; 39.72,8.44 40.12,8.44 v1(40.39,8.17) ; v1(30.55,16.75) 30.7,16.89 30.92,16.89 ; 16.18,18.14 15.69,17.65 15.84,17.5 16.28,17.5 ; v1(32.9,11.36) 32.98,11.36 33.32,11.69 ; 38.92,7.79 39.01,7.79 v1(39.31,7.49) 39.37,7.49 39.72,7.14 ; U1.AG33 U1.AH32 ; v1(39.35,13.88) 39.34,13.88 39.34,13.87 39.3,13.87 39.07,13.64 38.92,13.64 ; v1(39.35,13.88) 39.35,13.87 v1(39.35,13.08) 39.35,12.19 v1(39.3,12.14) 39.3,12.07 38.92,11.69 v1(39.26,11.35) 39.41,11.35 40.19,10.57 40.19,10.33 40.36,10.16 v1(40.36,10.08) 40.03,10.08 39.72,9.77 39.72,9.74 39.39,10.07 v1(39.39,10.08) ; v1(33.68,13.49) 33.47,13.49 33.32,13.64 ; 17,16.65 16.54,16.18 v1(16.54,16.12) ; 17,16.65 16.69,16.96 U1.AG28 ; 17,16.65 U1.AH27 ; v1(18.67,20.78) 18.67,20.96 18.39,21.23 17.32,21.23 17.06,20.97 v1(17.06,20.79) ; v1(34.46,9.91) 34.28,9.91 34.12,9.74 33.78,10.08 ; 32.52,14.29 32.57,14.29 v1(32.92,13.94) ; v1(32.68,19.95) 32.64,19.9 32.64,19.61 32.52,19.49 ; 36.52,9.74 v1(36.9,9.36) ; 38.12,5.84 37.87,5.59 v1(37.87,5.38) ; 33.32,17.54 32.94,17.92 v1(32.94,18.47) ; v1(34.72,6.53) 34.72,6.54 34.12,7.14 ; 37.32,11.69 37.32,11.6 37.88,11.04 38.12,11.04 38.12,10.93 38.53,10.52 v1(38.53,10.08) 38.52,10.08 38.45,10.08 v1(37.75,9.37) 37.7,9.32 ; 36.52,16.89 35.99,16.89 v1(35.97,16.92) ; v1(38.49,19.17) 38.17,19.49 38.12,19.49 ; U1.AN33 19.69,19.66 19.7,19.67 19.7,19.83 20.43,20.56 20.43,20.74 v1(20.45,20.76) ; v1(39.31,15.32) 39.36,15.32 ; 39.36,15.32 39.31,15.28 ; 39.36,15.32 39.63,15.59 40.13,15.59 v1(40.19,15.53) 40.27,15.46 C36.1 ; v1(16.18,18.14) 16.69,18.65 ; 31.72,7.79 31.35,7.42 v1(31.35,7.39) 31.27,7.39 31.02,7.14 30.69,7.14 v1(30.47,7.36) ; v1(20.34,17.26) 20.31,17.26 20.24,17.19 20.23,17.19 20.19,17.15 U1.AN28 ; 30.92,15.59 30.64,15.59 v1(30.28,15.95) ; C30.1 C31.1 ; U1.AE29 15.49,17.65 v1(15.21,17.37) 14.94,17.65 U1.AC29 ; 36.52,8.44 36.16,8.44 36.12,8.48 36.07,8.48 36.06,8.49 v1(36.03,8.49) ; 33.32,7.79 32.94,8.17 32.94,8.81 v1(32.92,8.84) 32.92,8.85 32.92,9.34 32.52,9.74 32.92,10.14 32.92,10.18 v1(32.92,10.18) 32.95,10.21 32.95,10.62 32.52,11.04 ; 38.12,14.29 v1(37.77,13.94) 37.75,13.92 37.6,13.92 37.32,13.64 ; 39.2,10.08 39.39,10.08 ; v1(31.45,11.51) 31.63,11.69 31.72,11.69 ; v1(20.22,15.01) 20.1,15.13 19.71,15.13 U1.AN24 ; v1(30.4,8.47) 30.42,8.47 30.42,8.46 30.53,8.46 30.55,8.44 30.92,8.44 ; 34.12,5.84 34.25,5.72 v1(35.76,5.72) ; 38.71,15.28 38.57,15.28 v1(38.53,15.31) 38.4,15.31 38.12,15.59 38.08,15.59 v1(37.8,15.88) ; v1(17.63,15.14) 17.69,15.07 U1.AJ23 17.69,14.2 v1(17.63,14.14) 17.63,13.71 U1.AJ21 17.69,13.16 v1(17.63,13.1) 17.63,12.71 U1.AJ19 ; v1(34.67,15.47) 34.55,15.59 34.12,15.59 ; 32.52,15.59 32.59,15.59 32.89,15.29 v1(32.89,15.27) ; 37.32,7.79 37.26,7.79 v1(36.91,7.44) 36.61,7.14 36.52,7.14 ; v1(40.14,18.52) 40.04,18.52 39.48,17.95 39.39,17.95 v1(39.34,17.91) 39.28,17.91 38.92,17.54 ; v1(14.96,20.83) 15.06,20.73 15.06,20.02 U1.AC33 ; U1.AC26 U1.AA26 U1.Y26 12.88,16.15 12.62,16.41 12.62,16.58 U1.W27 ; v1(36.65,5.41) 36.58,5.41 36.52,5.47 36.52,5.84 ; 34.12,8.44 34.12,8.53 34.37,8.79 34.64,8.79 34.9,9.05 v1(34.9,9.07) ; 31.72,17.54 31.57,17.54 31.32,17.8 31.32,17.81 v1(31.31,17.81) 31.3,17.81 30.92,18.19 30.39,18.19 30.07,17.88 v1(30.07,17.86) ; v1(30.33,9.55) 30.52,9.74 30.92,9.74 ; U1.AA30 13.64,18.2 v1(13.23,18.2)
  Inner1 w0.076: 37.95,17.58 37.9,17.58 37.88,17.55 37.62,17.55 37.59,17.58 37.49,17.58 ; 38.3,9.14 38.35,9.19 38.66,9.19 38.71,9.14
  Bottom Layer w0.203: v1(32.9,11.36) 32.8,11.45 C15.1 ; v1(39.3,12.14) 39.03,11.87 C16.1
  Bottom Layer w0.254: 37.04,8.81 37.04,9.23 v1(36.9,9.36) ; v1(35.31,16.05) 35.31,16.14 C26.1 ; v1(15.21,17.37) 15.21,17.06 C17.2 15.15,16.99 14.78,16.99 14.71,16.92 C9.1 C11.1 ; v1(30.4,8.47) 30.55,8.32 30.55,7.95 ; 36.53,4.78 36.53,5.31 36.63,5.41 v1(36.65,5.41) ; v1(38.61,17.86) 38.48,17.98 37.8,17.98 37.54,17.73 37.03,17.73 ; v1(32.68,19.95) 32.59,20.04 32.59,20.5 32.61,20.52 ; 38.94,15.7 38.94,15.69 v1(39.31,15.32) ; v1(21.03,16.56) 21.31,16.28 21.31,16.16 ; v1(32.92,13.94) 33.25,14.27 33.25,14.33 ; v1(12.67,16.64) 12.62,16.59 12.62,16.36 12.84,16.14 C10.1 ; 29.92,16.59 30.39,16.59 v1(30.55,16.75) 30.82,17.02 31.52,17.02 31.92,16.62 C43.1 ; v1(34.67,15.47) 34.77,15.57 35.13,15.57 ; v1(32.92,8.84) 33.09,9.01 33.09,9.47 ; 39.83,19.13 39.83,18.82 v1(40.14,18.52) ; C41.1 32.75,18.28 v1(32.94,18.47) ; v1(37.8,15.88) 37.71,15.79 C21.1 ; v1(34.46,9.91) 34.46,10.01 34.9,10.45 ; v1(32.28,5.23) 32.56,5.51 33.61,5.51 ; 29.79,15.57 29.9,15.57 v1(30.28,15.95) 30.72,15.95 C23.1 ; 21.31,16.16 21.31,15.95 20.57,15.95 20.55,15.92 ; 21.31,16.16 21.47,16 C46.2 ; 37.06,13.53 37.11,13.53 37.52,13.94 v1(37.77,13.94) ; v1(37.87,5.38) 38.01,5.52 C42.1
  vias: v1(40.36,11.12)
VCC-DRAM: length 75.8
  Top Layer w0.115: 28.5,9.91 28.51,9.9 28.51,9.78
  Top Layer w0.203: 29.51,16.29 29.51,15.77 30.28,15.01 30.85,15.01 30.92,14.94
  Top Layer w0.254: C36.2 C34.2 40.46,14.27 40.11,13.93 ; C31.2 C33.2 40.79,17.81 v1(40.16,17.81) 39.9,17.54 39.72,17.54 ; 36.52,14.94 36.2,14.94 v1(36.05,15.09) ; 40.11,13.93 v1(40.06,13.87) 39.94,13.87 39.72,13.64 ; 40.11,13.93 v1(40.11,14.65) ; 36.52,16.24 36.16,16.24 v1(35.97,16.05) ; C37.2 C35.2 40.11,11.94 v1(39.98,12.07) 39.72,11.8 39.72,11.69 ; v1(34.7,5.21) 34.62,5.28 33.88,5.28 33.32,5.84 ; 32.52,6.49 32.52,6.36 32.11,5.94 32.11,5.72 v1(31.65,5.26) ; v1(37.72,6.1) 37.72,6.1 38.12,6.49 ; 37.32,19.49 37.32,19.89 v1(37.44,20.02) 38,20.57 40.59,20.57 C30.2 ; 34.12,9.09 34.53,9.5 34.65,9.5 35,9.86 v1(35,9.88) ; 36.52,6.49 36.1,6.49 v1(36.07,6.53) 35.56,6.53 v1(35.28,6.81) 35.28,6.38 35.03,6.12 34.42,6.12 34.12,6.43 34.12,6.49 ; v1(38.5,18.53) 38.49,18.53 38.18,18.84 38.12,18.84 ; v1(36.02,7.42) 36.14,7.42 36.52,7.79 ; 38.12,11.69 38.26,11.84 v1(38.26,12.23) ; 30.92,11.69 30.62,11.69 v1(30.56,11.63) ; 30.92,13.64 30.55,13.64 30.48,13.72 ; 32.52,18.84 32.13,19.23 v1(32.13,19.23) ; 38.12,16.24 38.14,16.24 v1(38.46,15.93) ; v1(40.11,14.65) 40.13,14.67 ; v1(40.11,14.65) 40.01,14.65 39.72,14.94 ; v1(40.87,10.87) 40.89,10.85 C28.1 ; 29.51,16.29 29.16,16.29 v1(28.93,16.05) ; v1(32.12,11.4) 32.41,11.69 32.52,11.69 ; 34.12,10.39 35.28,10.39 35.53,10.14 v1(35.53,9.88) ; 34.12,17.54 33.78,17.88 v1(33.73,17.88) ; 32.52,9.09 32.21,9.4 v1(32.13,9.4) ; v1(34.62,16.05) 34.31,16.05 34.12,16.24 ; 32.94,16.49 32.94,16.54 32.81,16.54 32.52,16.24 ; v1(33.75,15.27) 33.76,15.27 33.76,15.27 33.8,15.27 34.12,14.94 ; 38.12,9.09 38.31,9.09 v1(38.55,8.85) ; v1(35.94,17.63) 36.03,17.54 36.52,17.54 ; v1(39.39,10.72) 39.72,10.39 ; 37.32,5.84 37.32,5.4 v1(37.28,5.35) ; 34.12,18.84 34.12,18.89 v1(33.76,19.25) ; R2.2 28.45,9.79 28.45,9.98 28.72,10.26 29.38,10.26 v1(29.46,10.34) 29.52,10.39 30.92,10.39 ; 36.52,18.84 36.05,18.84 v1(35.97,18.92) ; 38.12,13.64 38.12,13.63 v1(37.64,13.16) ; 33.32,19.49 33.29,19.52 33.29,19.82 33.27,19.84 33.27,19.93 v1(33.26,19.95) ; 32.52,13.64 32.28,13.64 v1(32.13,13.79) ; 36.52,9.09 36.07,9.54 v1(36.07,9.93) 36.07,9.93 36.52,10.38 36.52,10.39 ; 34.12,7.79 34.12,7.86 v1(34.59,8.33) ; v1(30.53,17.6) 30.59,17.54 30.92,17.54 ; C38.2 C39.2 40.61,6.32 40.26,6.67 40.26,7.39 v1(40.16,7.49) 39.86,7.79 39.72,7.79 ; v1(29.92,7.39) 29.92,7.49 30.23,7.79 30.92,7.79
  Bottom Layer w0.152: v1(13.69,15.15) 13.69,16.7 R3.2
  Bottom Layer w0.203: v1(31.65,5.26) 31.7,5.31 C14.2 ; C15.2 32.23,11.51 v1(32.12,11.4) ; v1(38.26,12.23) 38.46,12.04 C16.2 ; v1(35,9.88) v1(35.53,9.88)
  Bottom Layer w0.254: v1(14.19,15.15) v1(14.69,15.15) ; v1(14.19,15.15) 14.19,15.55 C11.2 ; v1(14.19,15.15) v1(13.69,15.15) v1(13.19,15.15) ; v1(14.69,15.15) 14.69,14.62 ; v1(14.69,15.15) 14.69,15.55 C9.2 ; v1(37.64,13.16) 37.18,13.16 37.06,13.03 ; C7.2 14.64,12.6 v1(14.69,12.65) ; v1(35.97,16.05) 35.63,15.72 35.63,15.51 v1(36.05,15.09) ; v1(14.69,12.65) v1(14.69,13.15) 14.68,13.16 C8.2 ; v1(14.69,12.65) v1(14.69,12.15) ; 36.53,17.73 36.04,17.73 v1(35.94,17.63) ; v1(30.53,17.6) 30.53,17.45 30.17,17.09 29.92,17.09 ; v1(34.7,5.21) 34.39,5.51 34.11,5.51 ; v1(40.87,10.87) 40.72,10.72 v1(39.39,10.72) ; 14.69,14.62 C40.2 ; 14.69,14.62 v1(14.69,14.15) ; 29.29,15.57 29.29,15.69 v1(28.93,16.05) ; v1(35.53,9.88) 35.4,10.01 35.4,10.45 35.55,10.45 v1(36.07,9.93) ; C27.1 29.96,7.43 v1(29.92,7.39) ; v1(38.46,15.93) 38.53,15.93 38.81,16.2 38.94,16.2 ; 37.03,4.78 37.28,5.02 v1(37.28,5.35) ; C42.2 v1(37.72,6.1) ; v1(32.95,16.49) 32.92,16.51 C43.2 ; 39.33,19.13 38.74,18.54 38.51,18.54 v1(38.5,18.53) ; v1(12.69,14.65) v1(12.69,15.15) ; v1(12.69,15.15) v1(13.19,15.15) ; v1(12.69,15.15) v1(12.69,15.65) ; v1(14.69,11.65) v1(14.69,12.15) ; v1(14.69,12.15) 14.61,12.07 C6.2 ; v1(36.07,6.53) 36.07,7.37 v1(36.02,7.42) ; v1(33.76,19.25) 33.86,19.35 33.86,19.84 ; 36.7,18.84 36.05,18.84 v1(35.97,18.92) ; C10.2 13.18,15.16 v1(13.19,15.15) ; C41.2 v1(33.73,17.88) ; v1(33.26,19.95) 33.11,20.09 33.11,20.52 ; v1(38.55,8.85) 38.51,8.81 37.54,8.81
  vias: v1(30.48,13.72)
VDD18-DRAM: length 7.5
  Top Layer w0.254: 15.19,16.15 U1.AD25
  Bottom Layer w0.254: C46.1 21.51,15.42 20.55,15.42 ; C17.1 v1(15.19,16.15) 15.84,16.15 16.43,15.57 19.38,15.57 19.53,15.42 20.55,15.42 ; 20.55,15.42 20.57,15.45
VDD18-LPDDR: length 24.9
  Top Layer w0.102: 37.32,9.74 v1(37.67,10.09)
  Top Layer w0.254: C20.2 C19.1 40.75,8.7 40.05,9.4 v1(40.03,9.4) 39.72,9.09 ; 39.72,16.24 v1(40.26,16.24) 40.42,16.08 C24.2 ; 30.92,16.24 30.97,16.24 v1(31.32,16.59) ; v1(36.89,15.83) 36.9,15.83 36.91,15.82 37.09,15.82 37.32,15.59 ; 33.32,9.74 33.59,9.47 v1(33.73,9.47) ; v1(33.75,16.02) 33.72,16.02 33.32,15.62 33.32,15.59
  Top Layer w0.305: 30.92,9.09 31.25,9.42 31.29,9.42 v1(31.29,9.43)
  Bottom Layer w0.203: v1(33.75,16.02) 33.27,15.55 C25.2 32,14.86 31.32,15.54 C23.2
  Bottom Layer w0.254: v1(40.26,16.24) 40.3,16.24 ; v1(36.89,15.83) 37.13,15.59 C21.2 ; C26.2 33.83,16.02 v1(33.75,16.02) ; v1(31.29,9.43) 31.29,9.96 31.57,10.24 32.33,10.24 32.72,10.62 33.22,10.62 33.5,10.34 33.5,9.71 v1(33.73,9.47) 36.32,9.47 36.5,9.65 36.5,10.24 36.73,10.46 37.29,10.46 v1(37.67,10.09) 37.67,10.09 38.1,10.52 38.73,10.52 38.94,10.31 38.94,9.86 39.34,9.45 39.98,9.45 v1(40.03,9.4) ; C23.2 v1(31.32,16.59)
SAA0: length 16.5
  Top Layer w0.076: v1(18.26,18.67) 18.26,18.72 17.94,19.04 17.94,19.4 U1.AJ33
  Top Layer w0.115: v1(28.35,16.05) 28.7,15.7 28.86,15.7 29.8,14.76 30.53,14.76 30.64,14.64 31.42,14.64 31.72,14.94
  Inner5 w0.115: v1(18.26,18.67) 18.33,18.75 20.7,18.75 21.69,17.75 25.86,17.75 26.64,16.97 26.93,16.97 27.84,16.05 v1(28.35,16.05)
SAA1: length 17.3
  Top Layer w0.076: v1(18.16,18.14) 17.94,18.36 17.94,18.79 17.69,19.04 U1.AJ32
  Top Layer w0.115: v1(28.73,15.32) 28.73,14.99 29.79,13.92 30.15,13.92 30.37,14.14 30.67,14.14 30.82,14 31.05,14 31.35,14.29 31.72,14.29
  Inner5 w0.115: v1(28.73,15.32) 28.72,15.32 28.56,15.47 27.9,15.47 26.77,16.6 26.49,16.6 25.74,17.35 21.7,17.35 21.41,17.65 20.79,17.65 19.97,18.47 18.53,18.47 18.2,18.14 v1(18.16,18.14)
SAA2: length 23.6
  Top Layer w0.102: 37.32,14.94 37.29,14.94 36.96,14.61 v1(36.96,14.61)
  Top Layer w0.115: U1.AG30 16.69,18.11 v1(17.14,17.65)
  Inner5 w0.076: v1(17.14,17.65) 17.2,17.65 17.53,17.98 17.83,17.98 18.01,17.81 19.02,17.81 19.08,17.86
  Inner5 w0.115: 19.08,17.86 19.25,17.86 20.22,16.89 20.78,16.89 20.86,16.97 21.13,16.97 21.51,16.59 25.46,16.59 26.19,15.86 26.47,15.86 27.58,14.75 28.25,14.74 28.46,14.53 29.04,14.53 29.57,15.05 32.45,15.05 32.61,14.88 34,14.88 34.11,14.77 34.11,14.55 34.49,14.17 35,14.17 35.51,14.68 36.89,14.68 v1(36.96,14.61)
SAA3: length 26.4
  Top Layer w0.115: U1.AG29 16.69,17.6 17.14,17.15 v1(17.14,17.12) ; v1(37.8,14.62) 38.12,14.94
  Inner2 w0.076: 19.25,16.97 19.05,16.76 17.42,16.76 17.14,17.04 v1(17.14,17.12)
  Inner2 w0.115: v1(37.8,14.62) 37.4,15.01 36.73,15.01 36.4,14.68 36.4,13.54 36.27,13.41 35.26,13.41 35.15,13.51 35.15,14.66 34.72,15.09 34.49,15.09 33.96,15.62 32.56,15.62 32.36,15.42 31.65,15.42 30.73,16.33 30.43,16.33 29.54,17.22 29.16,17.22 28.94,17.44 20.82,17.44 20.65,17.6 19.89,17.6 19.25,16.97
SAA4: length 24.9
  Top Layer w0.102: v1(38.53,14.53) 38.53,14.56 38.92,14.94
  Top Layer w0.115: v1(17.69,17.64) U1.AJ30
  Inner5 w0.076: 19.14,17.6 17.73,17.6 v1(17.69,17.64)
  Inner5 w0.115: 19.14,17.6 20.18,16.56 20.52,16.56 20.88,16.21 25.32,16.21 26.03,15.49 26.31,15.49 27.43,14.38 28.09,14.38 28.31,14.16 29.2,14.16 29.72,14.68 31.29,14.68 31.45,14.53 32.99,14.53 33.55,13.97 33.93,13.97 34.24,13.67 34.24,13.54 34.37,13.41 37.08,13.41 37.24,13.56 38.02,13.56 38.53,14.07 v1(38.53,14.53)
SAA5: length 29.5
  Top Layer w0.115: v1(17.2,18.16) 17.2,18.16 U1.AJ31 ; v1(38.4,13.28) 38.56,13.44 38.56,13.92 38.92,14.28 38.92,14.29
  Inner5 w0.115: v1(17.2,18.16) 17.12,18.16 16.79,17.83 16.79,16.99 17.3,16.48 18.82,16.48 19.08,16.23 19.08,15.65 20.42,14.3 20.65,14.3 21.03,13.92 25.1,13.92 25.52,13.5 26.16,13.5 27.73,11.93 29.65,11.93 30.45,11.12 31.37,11.12 31.78,10.72 31.78,10.67 32.08,10.36 32.54,10.36 32.72,10.54 33.25,10.54 33.45,10.34 33.96,10.34 34.24,10.62 35.97,10.62 37.9,12.55 37.9,12.78 v1(38.4,13.28)
SAB0: length 23.2
  Top Layer w0.115: 17.65,15.69 U1.AJ25 17.65,15.69 ; 17.65,15.69 v1(17.65,16.11) ; v1(31.32,10.69) 31.62,10.39 31.72,10.39
  Inner2 w0.076: v1(17.65,16.11) 17.65,16.23 18.01,16.59 19.13,16.59
  Inner2 w0.115: 19.13,16.59 19.53,16.59 19.66,16.71 20.29,16.71 20.7,17.12 21.46,17.12 21.57,17.01 21.57,16.87 21.68,16.75 21.84,16.75 21.95,16.87 21.95,17.01 22.07,17.12 22.22,17.12 22.33,17.01 22.33,16.87 22.45,16.75 22.6,16.75 22.71,16.87 22.71,17.01 22.83,17.12 22.98,17.12 23.09,17.01 23.09,16.87 23.21,16.75 23.36,16.75 23.48,16.87 23.48,17.01 23.59,17.12 23.74,17.12 23.86,17.01 23.86,16.87 23.97,16.75 24.12,16.75 24.24,16.87 24.24,17.01 24.35,17.12 25.04,17.12 25.15,17.01 25.15,16.52 25.26,16.41 25.42,16.41 25.53,16.52 25.53,17.01 25.64,17.12 25.8,17.12 25.91,17.01 25.91,16.52 26.03,16.41 26.18,16.41 26.29,16.52 26.29,17.01 26.41,17.12 26.56,17.12 26.87,16.8 26.87,16.19 27.9,15.16 28.19,15.16 30.94,12.42 30.94,11.07 v1(31.32,10.69)
SAB1: length 22.6
  Top Layer w0.115: 31.72,11.04 31.61,11.15 31.27,11.15 31.06,11.35 30.81,11.35 30.63,11.17 30.11,11.17 29.77,11.51 29.42,11.51 v1(29.41,11.5) ; v1(17.12,16.11) 17.12,15.72 U1.AH25
  Inner2 w0.115: v1(29.41,11.5) 29.41,12.38 29.28,12.51 29.12,12.51 29.01,12.4 29.01,12.02 28.85,11.86 28.47,11.86 28.24,12.09 28.24,12.27 28.8,12.82 28.8,13 27.74,14.06 27.34,14.06 26.16,15.24 24.12,15.24 24,15.35 24,15.7 23.89,15.81 23.74,15.81 23.62,15.7 23.62,15.35 23.51,15.24 23.36,15.24 23.24,15.35 23.24,15.7 23.13,15.81 22.98,15.81 22.86,15.7 22.86,15.35 22.75,15.24 22.59,15.24 22.48,15.35 22.48,15.7 22.37,15.81 22.21,15.81 22.1,15.7 22.1,15.35 21.98,15.24 21.06,15.24 20.55,15.75 17.48,15.75 v1(17.12,16.11)
SAB2: length 23.3
  Top Layer w0.102: v1(36.93,10.01) 37.32,10.39
  Top Layer w0.115: U1.AL25 v1(18.69,16.11)
  Inner2 w0.115: v1(36.93,10.01) 36.58,10.36 34.42,10.36 33.88,9.83 32.77,9.83 32.66,9.93 30.98,9.93 29.79,11.11 29.79,12.52 27.89,14.43 27.5,14.43 26.23,15.7 24.46,15.7 24.08,16.08 21.92,16.08 21.65,15.81 20.87,15.81 20.68,16 18.8,16 v1(18.69,16.11)
SAB3: length 25.3
  Top Layer w0.115: U1.AK25 18.16,15.68 v1(18.16,16.11) ; 38.12,10.39 37.79,10.72 35.97,10.72 v1(35.33,11.35)
  Inner2 w0.076: 19.69,16.26 19.18,16.26 19,16.43 18.56,16.43 18.24,16.11 v1(18.16,16.11)
  Inner2 w0.115: 19.69,16.26 19.79,16.36 20.7,16.36 20.88,16.18 21.39,16.18 21.67,16.46 24.21,16.46 24.59,16.08 26.47,16.08 27.75,14.8 28.04,14.8 30.17,12.66 30.17,11.3 31.17,10.31 32.44,10.31 32.79,10.67 33.12,10.67 33.48,10.31 33.91,10.31 34.34,10.74 34.72,10.74 v1(35.33,11.35)
SAB4: length 26
  Top Layer w0.102: v1(37.49,12.65) 37.49,12.62 37.69,12.42 37.69,11.59 37.93,11.35 38.38,11.35 38.61,11.12 38.61,10.9 38.92,10.59 38.92,10.39
  Top Layer w0.115: U1.AJ27 17.69,17.06 v1(17.65,17.09)
  Inner5 w0.076: 19.05,17.35 18.99,17.41 17.97,17.41 v1(17.65,17.09)
  Inner5 w0.115: 19.05,17.35 19.05,17.32 20.12,16.26 20.4,16.26 20.83,15.82 25.18,15.82 25.88,15.13 26.16,15.13 27.28,14.01 27.94,14.01 28.16,13.79 30,13.79 30.38,14.18 32.38,14.18 32.54,14.02 32.54,13.74 33.25,13.03 37.11,13.03 v1(37.49,12.65)
SAB5: length 27
  Top Layer w0.102: v1(38.79,12.83) 38.63,12.67 38.63,11.4 38.92,11.12 38.92,11.04
  Top Layer w0.115: U1.AL29 v1(18.69,18.13)
  Inner5 w0.115: v1(38.79,12.83) 38.94,12.98 38.94,14.71 38.71,14.94 38.28,14.94 38.25,14.96 37.08,14.96 36.58,15.47 35.23,15.47 34.85,15.09 34.49,15.09 33.95,15.63 32.62,15.63 32.46,15.47 29.44,15.47 28.88,14.91 28.6,14.91 28.4,15.11 27.74,15.11 26.62,16.23 26.34,16.23 25.6,16.97 21.56,16.97 21.22,17.31 20.82,17.31 20,18.13 v1(18.69,18.13)
SCKE0-A: length 22
  Top Layer w0.076: U1.AM31 19.34,18.65 19.59,18.9 19.86,18.9 20.18,19.21
  Top Layer w0.115: 33.32,14.29 33.32,14.06 33.43,13.94 34.47,13.94 v1(34.62,13.79) ; v1(27.37,17.03) 26.96,17.03 24.78,19.21 20.18,19.21
  Inner2 w0.115: v1(27.37,17.03) 27.37,16.51 28.2,15.68 28.88,15.68 29.75,14.81 30.4,14.81 30.96,14.25 30.96,13.13 31.7,12.4 33.86,12.4 34.62,13.16 v1(34.62,13.79)
SCKE0-B: length 21.4
  Top Layer w0.076: 21.74,16.89 20.88,16.89 20.64,16.65
  Top Layer w0.097: U1.AN27 20.64,16.65
  Top Layer w0.115: 21.74,16.89 21.87,16.76 23.98,16.76 26.24,14.5 26.24,13.21 26.67,12.78 27.25,12.78 28.55,11.48 28.74,11.48 28.91,11.65 28.91,11.86 28.09,12.67 v1(28.02,12.67) ; v1(33.73,11.35) 33.42,11.04 33.32,11.04
  Inner5 w0.115: v1(33.73,11.35) 33.9,11.35 34.06,11.52 34.06,11.76 33.93,11.89 32.72,11.89 32.08,12.52 30.1,12.52 29.95,12.67 v1(28.02,12.67)
SCKE1-A: length 22.4
  Top Layer w0.076: U1.AL31 18.94,18.9 19.29,18.9 19.44,19.05 19.44,19.29 19.55,19.4 19.79,19.4 20.19,19.8
  Top Layer w0.102: v1(34.62,14.58) 34.34,14.3 34.14,14.3 34.13,14.29 34.12,14.29
  Top Layer w0.115: v1(29.03,16.81) 28.81,16.6 28.41,16.6 28.11,16.9 28.11,17.35 27.75,17.7 27.13,17.7 25.02,19.81 20.28,19.81 20.26,19.8 20.19,19.8
  Inner2 w0.115: v1(34.62,14.58) 34.37,14.58 34.09,14.86 33.53,14.86 33.35,14.68 33.35,13.67 33.1,13.41 32.72,13.41 32.51,13.61 32.51,14.5 32.21,14.81 31.7,14.81 30.96,15.54 30.12,15.54 29.9,15.77 29.9,16.33 29.43,16.8 29.03,16.8 v1(29.03,16.81)
SCKE1-B: length 21.8
  Top Layer w0.076: U1.AM27 19.44,16.9 19.9,16.9 19.99,16.81 20.55,16.81 20.8,17.07 21.57,17.07
  Top Layer w0.115: 21.57,17.07 21.6,17.09 24.03,17.09 26.51,14.62 26.51,13.4 26.8,13.11 27.25,13.11 v1(27.42,13.27) ; 34.12,11.04 34.16,11.04 v1(34.49,11.38)
  Inner5 w0.115: v1(34.49,11.38) 34.82,11.38 35.31,11.86 35.31,12.17 35.2,12.27 35.01,12.27 34.89,12.15 34.89,11.87 34.78,11.76 34.55,11.76 34.43,11.87 34.43,12.15 34.32,12.27 32.89,12.27 32.26,12.9 30.24,12.9 30.09,13.06 27.79,13.06 27.57,13.27 v1(27.42,13.27)
SCKN-A: length 21.6
  Top Layer w0.076: 37.05,13.34 37.05,13.36 37.02,13.39 37.02,14.21 37.1,14.29 37.32,14.29 ; U1.AN30 19.74,18.2 20.15,18.2 20.32,18.36 20.42,18.36 20.55,18.24 20.65,18.24 20.78,18.36
  Top Layer w0.127: 20.78,18.36 24.48,18.36 27.74,15.11 27.74,14.81 29.71,12.83 36.82,12.83 37.05,13.06 37.05,13.34
SCKN-B: length 21.2
  Top Layer w0.076: U1.AN29 19.79,17.65 19.94,17.8 20.67,17.8 20.8,17.67 20.82,17.67 20.82,17.66 21.17,17.66 21.44,17.93 22.39,17.93 22.41,17.91 22.58,17.91 ; 37.32,11.04 37.06,11.3 37.06,11.84 36.54,12.36 36.47,12.36 36.45,12.39 36.39,12.39 36.36,12.41 36.35,12.41
  Top Layer w0.127: 36.35,12.41 29.5,12.41 27.23,14.69 27.23,14.94 24.26,17.91 22.58,17.91
SCKP-A: length 21.6
  Top Layer w0.076: 20.78,18.62 20.27,18.62 20.05,18.4 19.44,18.4 U1.AM30 ; 36.79,13.34 36.79,13.36 36.82,13.39 36.82,13.99 36.52,14.29
  Top Layer w0.127: 20.78,18.62 24.59,18.62 27.99,15.21 27.99,14.91 29.82,13.09 36.72,13.09 36.79,13.16 36.79,13.34
SCKP-B: length 21.9
  Top Layer w0.076: 22.58,17.65 22.38,17.65 22.3,17.73 22.09,17.73 22.01,17.65 22.01,17.58 21.93,17.5 21.78,17.5 21.71,17.58 21.71,17.65 21.63,17.73 21.52,17.73 21.25,17.46 20.73,17.46 20.73,17.46 20.71,17.46 20.58,17.59 20.06,17.59 19.86,17.4 19.44,17.4 U1.AM28 ; 36.52,11.04 36.78,11.04 36.86,11.12 36.86,11.76 36.45,12.16 36.35,12.16
  Top Layer w0.127: 22.58,17.65 24.16,17.65 26.97,14.83 26.97,14.58 29.39,12.16 36.35,12.16
SCS0-A: length 21
  Top Layer w0.076: 20.34,19.51 20.19,19.51 19.83,19.15 U1.AN32
  Top Layer w0.115: v1(27.89,16.56) 27.74,16.71 27.74,17.2 27.53,17.4 27,17.4 24.89,19.51 20.34,19.51 ; v1(33.73,14.5) 33.73,14.58 33.37,14.94 33.32,14.94
  Inner2 w0.115: v1(33.73,14.5) 34.11,14.12 34.11,13.16 33.73,12.78 31.86,12.78 31.75,12.89 31.75,14.12 30.7,15.18 29.97,15.18 29.53,15.62 29.53,16.18 29.27,16.43 28.02,16.43 v1(27.89,16.56)
SCS0-B: length 23.7
  Top Layer w0.115: U1.AK29 18.19,17.62 v1(18.72,17.09) ; 33.32,10.39 33.43,10.39 v1(33.73,10.69)
  Inner5 w0.115: v1(33.73,10.69) 34.01,10.97 35.51,10.97 35.71,11.18 35.71,12.45 35.51,12.65 33.1,12.65 32.42,13.33 30.34,13.33 30.24,13.42 28,13.42 27.79,13.64 27.13,13.64 26.01,14.76 25.73,14.76 25,15.48 20.76,15.48 20.35,15.9 20.09,15.9 18.9,17.09 v1(18.72,17.09)
SCS1-A: length 20.7
  Top Layer w0.076: U1.AM32 19.19,19.3 19.44,19.55 19.44,19.97 20.12,20.66 20.12,21.01 20.27,21.16
  Top Layer w0.115: v1(28.5,17.04) 28.47,17.07 28.47,17.5 27.92,18.06 27.28,18.06 25.22,20.12 21.13,20.12 20.85,20.4 20.85,20.96 20.65,21.16 20.27,21.16 ; v1(32.11,15.88) 32.13,15.85 32.13,15.06 32.25,14.94 32.52,14.94
  Inner5 w0.115: v1(32.11,15.88) 31.7,15.88 31.58,15.99 31.58,16.09 31.47,16.21 31.24,16.21 31.13,16.09 31.13,15.99 31.01,15.88 30.76,15.88 30.68,15.95 30.68,16.22 30.57,16.33 30.4,16.33 30.19,16.55 29.91,16.55 29.79,16.44 29.79,15.94 29.68,15.82 29.45,15.82 29.34,15.94 29.34,16.32 29.22,16.43 28.38,16.43 28.27,16.55 28.27,16.93 28.38,17.04 v1(28.5,17.04)
SCS1-B: length 22.6
  Top Layer w0.102: U1.AK27 18.19,17.09 v1(18.19,17.09)
  Top Layer w0.115: v1(32.21,10.72) 32.21,10.7 32.52,10.39
  Inner5 w0.115: v1(32.21,10.72) 32.36,10.72 32.51,10.87 32.51,11.58 32.05,12.04 30.06,12.04 29.81,12.29 27.89,12.29 26.31,13.87 25.64,13.87 25.48,14.03 25.48,14.48 24.82,15.14 24.71,15.14 24.59,15.02 24.59,14.85 24.48,14.73 24.25,14.73 24.13,14.85 24.13,15.02 24.02,15.14 23.79,15.14 23.68,15.02 23.68,14.81 23.56,14.7 23.33,14.7 23.22,14.81 23.22,15.02 23.11,15.14 22.88,15.14 22.76,15.02 22.76,14.85 22.65,14.73 22.42,14.73 22.3,14.85 22.3,15.02 22.19,15.14 21.96,15.14 21.85,15.02 21.85,14.85 21.73,14.73 21.51,14.73 21.39,14.85 21.39,15.02 21.28,15.14 21.12,15.14 21.01,15.02 21.01,14.83 20.88,14.7 20.72,14.7 20.6,14.83 20.6,15.19 20.4,15.39 19.96,15.39 19.84,15.52 19.84,15.65 19.73,15.75 19.51,15.75 19.41,15.86 19.41,16.21 18.87,16.74 18.08,16.74 17.98,16.84 17.98,17 18.08,17.09 v1(18.19,17.09)
SDQ0: length 21.9
  Top Layer w0.115: v1(33.76,16.56) 33.76,16.59 33.45,16.89 33.32,16.89 ; U1.AE28 15.75,17.09 v1(16.1,17.09)
  Inner2 w0.115: v1(33.76,16.56) 33.71,16.56 33.43,16.84 32.08,16.84 31.45,17.48 31.11,17.48 30.94,17.65 30.94,18.03 30.26,18.71 22,18.71 21.59,19.11 19.29,19.11 19.04,19.37 16.93,19.37 16.56,19 16.56,17.55 v1(16.1,17.09)
SDQ1: length 21.3
  Top Layer w0.076: U1.AE27 16.01,16.65 v1(16.08,16.58)
  Top Layer w0.115: 33.32,16.24 33.08,16 32.94,16 32.92,15.98 v1(32.91,15.98)
  Inner2 w0.076: 17.25,19.1 17.32,19.18 18.8,19.18 18.87,19.1
  Inner2 w0.115: 17.25,19.1 16.99,19.1 16.79,18.9 16.79,17.27 16.1,16.58 v1(16.08,16.58) ; v1(32.91,15.98) 32.42,16.46 31.95,16.46 31.36,17.06 30.94,17.06 30.89,17.11 30.29,17.11 29.71,17.68 29.71,18.07 29.49,18.29 21.95,18.29 21.45,18.78 19.19,18.78 18.87,19.1
SDQ2: length 22.3
  Top Layer w0.115: 31.72,16.89 31.41,17.21 30.32,17.21 30.02,17.5 29.98,17.5 29.95,17.53 29.93,17.53 29.72,17.74 29.72,17.96 29.46,18.21 29.31,18.21 28.12,19.41 27.53,19.41 27.36,19.23 27.36,19 27.58,18.77 28.3,18.77 29.23,17.83 v1(29.31,17.83) ; U1.AG32 17.14,18.7
  Inner2 w0.076: v1(17.14,18.69) 17.45,19 18.54,19 18.59,18.95
  Inner2 w0.115: v1(29.31,17.83) 29.29,17.86 21.74,17.86 21.18,18.42 20.12,18.42 20.01,18.3 20.01,18.1 19.89,17.98 19.66,17.98 19.55,18.1 19.55,18.3 19.44,18.42 19.13,18.42 18.59,18.95
SDQ3: length 21.3
  Top Layer w0.076: v1(19.2,20.78) 18.55,20.13 18.54,20.13 18.43,20.02 18.43,20 18.34,19.91 17.45,19.91 U1.AH33
  Top Layer w0.115: v1(27.69,20.78) 27.64,20.73 27.64,20.42 27.79,20.27 28.32,20.27 28.45,20.14 28.45,19.86 28.32,19.74 27.33,19.74 27,19.41 27,18.82 27.38,18.44 28.11,18.44 29.25,17.3 29.73,17.3 29.95,17.08 30.06,17.08 30.17,16.97 30.17,16.59 30.79,15.97 31.45,15.97 31.72,16.24
  Inner2 w0.115: v1(27.69,20.78) 27.31,21.15 19.58,21.15 v1(19.2,20.78)
SDQ4: length 18.8
  Top Layer w0.115: U1.AE30 15.23,18.15 v1(15.19,18.11) ; v1(29.08,19.5) 29.44,19.86 30.12,19.86 30.81,19.18 31.39,19.18 31.72,18.84
  Inner2 w0.115: v1(29.08,19.5) 29.03,19.56 22.63,19.56 22.43,19.76 19.63,19.76 19.56,19.84 16.43,19.84 15.7,19.1 15.7,18.52 15.29,18.11 v1(15.19,18.11)
SDQ5: length 21.1
  Top Layer w0.076: v1(15.99,20.79) 15.57,20.37 15.57,19.89 15.44,19.75 15.44,19.4 U1.AD32
  Top Layer w0.115: 32.95,19.17 32.97,19.15 33.01,19.15 33.32,18.84
  Inner2 w0.115: v1(32.95,19.17) 32.91,19.21 32.71,19.21 29.93,21.99 17.14,21.99 15.99,20.84 v1(15.99,20.79)
SDQ6: length 20.8
  Top Layer w0.115: v1(29.77,19.5) 29.61,19.5 29.23,19.13 29.23,18.64 29.34,18.54 29.46,18.54 29.54,18.62 29.54,19.06 29.62,19.14 29.79,19.14 29.87,19.05 29.87,18.66 29.98,18.54 30.11,18.54 30.23,18.66 30.23,19.05 30.3,19.13 30.45,19.13 30.56,19.02 30.56,18.71 30.73,18.54 31.37,18.54 31.72,18.19 ; U1.AE31 15.73,18.69 v1(16.16,18.69)
  Inner2 w0.115: v1(16.16,18.69) 16.16,19.05 16.71,19.61 19.2,19.61 19.35,19.46 21.84,19.46 22.17,19.13 29.39,19.13 v1(29.77,19.5)
